# EAGLE design networking-node (EAGLE 7.6.0)
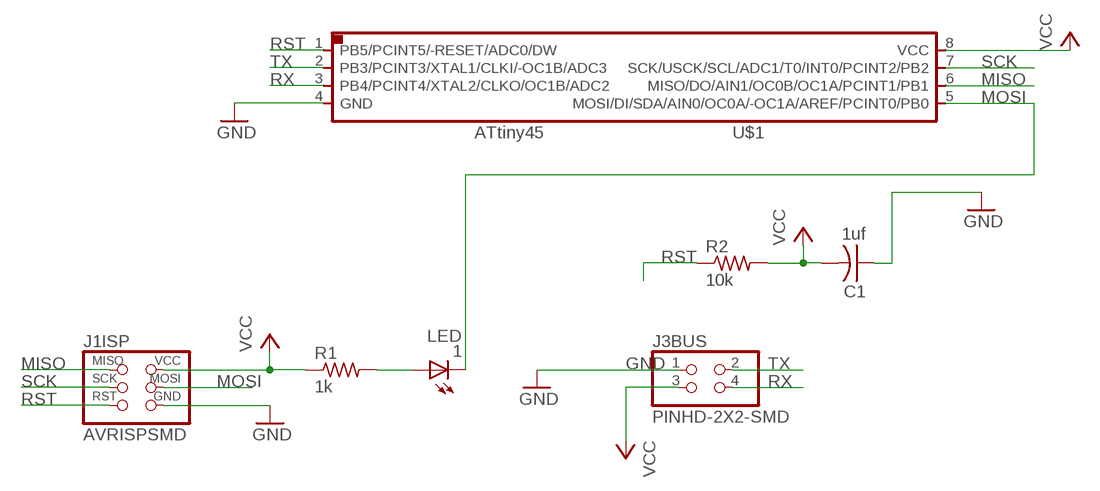
[diagram p0: schematic, sheet 1]

## Parts
1  LED  [LED1206]
C1  1uf  CAP-US1206FAB  [C1206FAB]
J1ISP  AVRISPSMD  [2X03SMD]
J3BUS  PINHD-2X2-SMD  [2X02SMD]
R1  1k  RES-US1206  [R1206]
R2  10k  RES-US1206  [R1206]
U$1  ATTINY45SI  [SOIC8]

## Nets
GND: C1.1 J1ISP.6(GND) J3BUS.1 U$1.4(GND)
MISO: J1ISP.1(MISO) U$1.6(MISO/DO/AIN1/OC0B/OC1A/PCINT1/PB1)
MOSI: 1.2(C) J1ISP.4(MOSI) U$1.5(MOSI/DI/SDA/AIN0/OC0A/-OC1A/AREF/PCINT0/PB0)
N$15: 1.1(A) R1.2
RST: J1ISP.5(RST) R2.1 U$1.1(PB5/PCINT5/-RESET/ADC0/DW)
RX: J3BUS.4 U$1.3(PB4/PCINT4/XTAL2/CLKO/OC1B/ADC2)
SCK: J1ISP.3(SCK) U$1.7(SCK/USCK/SCL/ADC1/T0/INT0/PCINT2/PB2)
TX: J3BUS.2 U$1.2(PB3/PCINT3/XTAL1/CLKI/-OC1B/ADC3)
VCC: C1.2 J1ISP.2(VCC) J3BUS.3 R1.1 R2.2 U$1.8(VCC)

## Library data of the parts
1 = fab:LED: LED
C1 = fab:CAP-US
J1ISP = fab:AVRISP
J3BUS = fab:PINHD-2X2-SMD
R1 R2 = fab:RES-US: Resistor (US Symbol) Variants with postfix FAB are widened to allow the routing of internal traces
U$1 = fab:ATTINY45

## Board
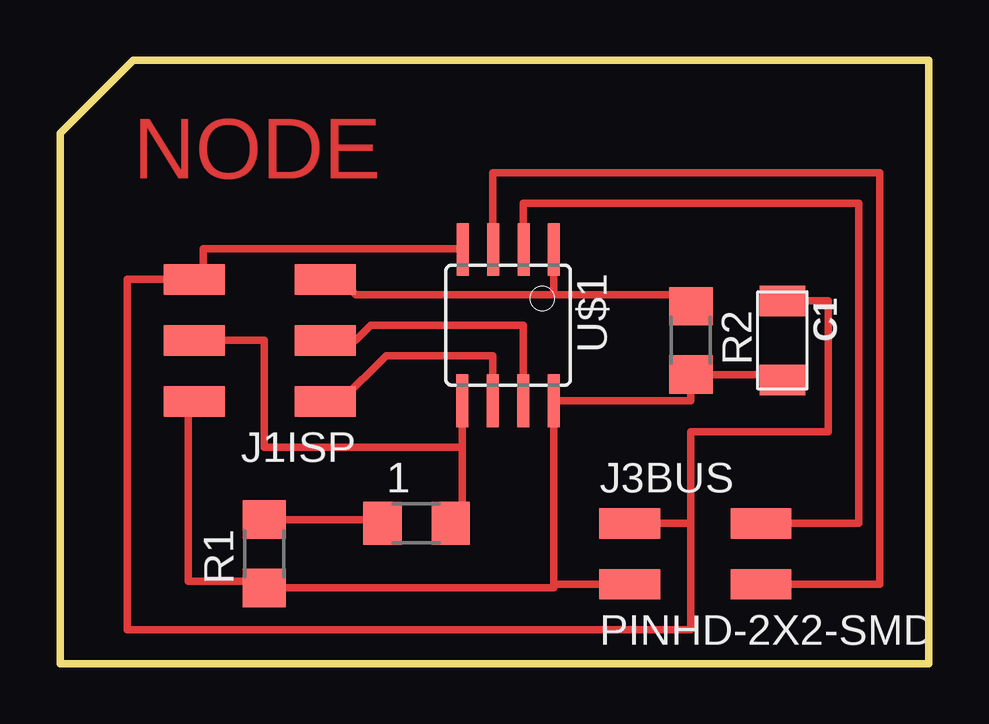
[diagram p1: board, top side]

Size 36.2 x 25.15 mm. Coordinates in mm from the lower left corner, seen from the top.
Outline: 3.05,25.15 0,22.1 0,0 36.2,0 36.2,25.15 3.05,25.15
Copper layers (1*16): Top 0.035mm / dielectric 1.5mm / Bottom 0.035mm
Design rules "default": minimum track width 10mil, minimum drill 24mil, track to track 8mil, track to pad 8mil, pad to pad 8mil, via to via 8mil, smd to smd 8mil, copper to edge 40mil, drill to drill 8mil, minimum pad ring 10mil, minimum via ring 8mil, stop-mask expansion 4mil, vias tented up to drill 0mil, thermal gap 10mil

### Footprints (pad centres in the part's own frame; a part is rotated, then mirrored left to right if it is on the bottom)
LED1206 = smd 1.6 x 1.803: 1 -1.422,0; 2 1.422,0
C1206FAB = smd 1.27 x 1.905: 1 -1.651,0; 2 1.651,0
2X03SMD = smd 2.54 x 1.27: 1 -2.54,2.54; 2 2.92,2.54; 3 -2.54,0; 4 2.92,0; 5 -2.54,-2.54; 6 2.92,-2.54
2X02SMD = smd 2.54 x 1.27: 1 -2.54,1.27; 2 2.92,1.27; 3 -2.54,-1.27; 4 2.92,-1.27
R1206 = smd 1.6 x 1.803: 1 -1.422,0; 2 1.422,0
SOIC8 = smd 0.5 x 2.2: 1 -1.905,-3.154; 2 -0.645,-3.154; 3 0.625,-3.154; 4 1.895,-3.154; 5 1.905,3.154; 6 0.635,3.154; 7 -0.635,3.154; 8 -1.905,3.154

### Placement (x,y rotation side)
1  14.86,5.84 0 top
C1  30.1,13.46 270 top
J1ISP  8.51,13.46 180 top
J3BUS  26.29,4.57 0 top
R1  8.51,4.57 90 top
R2  26.29,13.46 270 top
U$1  18.67,14.1 180 top

### Tracks (layer width: path | path; a pad name or v marks a point on that pad's centre or on a via)
GND
  Top 0.305: U$1.4 16.77,17.27 5.97,17.27 5.97,16 J1ISP.6 2.79,16 2.79,1.4 26.29,1.4 26.29,5.84 | C1.1 32,15.11 32,9.65 26.29,9.65 26.29,5.84 | J3BUS.1 26.29,5.84
MISO
  Top 0.305: J1ISP.1 11.68,10.92 13.59,12.83 18.03,12.83 U$1.6
MOSI
  Top 0.305: J1ISP.4 8.51,13.46 8.51,9.02 16.76,9.02 | 16.76,9.02 16.76,5.84 1.2 | 16.76,9.02 U$1.5
N$15
  Top 0.305: R1.2 13.44,5.99 1.1
RST
  Top 0.305: J1ISP.5 11.68,16 12.32,15.37 20.57,15.37 | U$1.1 20.57,15.37 | 20.57,15.37 26.29,15.37 R2.1
RX
  Top 0.305: U$1.3 18.03,17.25 18.03,20.45 34.16,20.45 34.16,3.3 J3BUS.4
SCK
  Top 0.305: U$1.7 19.3,14.1 12.95,14.1 12.32,13.46 J1ISP.3
TX
  Top 0.305: U$1.2 19.3,17.25 19.3,19.18 33.27,19.18 33.27,5.84 J3BUS.2
VCC
  Top 0.305: C1.2 30.1,12.04 R2.2 26.29,10.94 U$1.8 20.57,3.3 | J1ISP.2 5.33,10.92 5.33,3.43 8.51,3.43 R1.1 20.57,3.15 20.57,3.3 | J3BUS.3 20.57,3.3

### Text on the board
Top: NODE